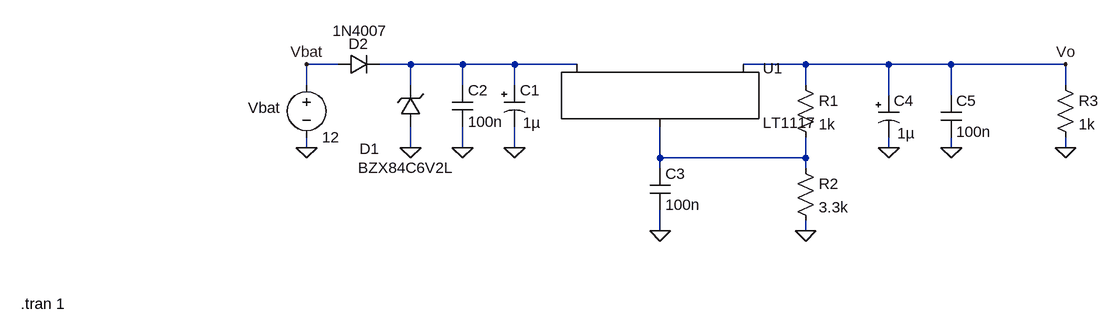
[diagram p0: schematic Regulador.asc]
Regulador.asc, the LTspice schematic file:
Version 4.1
SHEET 1 880 680
WIRE -304 128 -352 128
WIRE -192 128 -240 128
WIRE -112 128 -192 128
WIRE -32 128 -112 128
WIRE 64 128 -32 128
WIRE 416 128 320 128
WIRE 544 128 416 128
WIRE 640 128 544 128
WIRE 816 128 640 128
WIRE -352 160 -352 128
WIRE -192 160 -192 128
WIRE -112 160 -112 128
WIRE -32 160 -32 128
WIRE 416 160 416 128
WIRE 816 160 816 128
WIRE 544 176 544 128
WIRE 640 176 640 128
WIRE -352 256 -352 240
WIRE -192 256 -192 224
WIRE -112 256 -112 224
WIRE -32 256 -32 224
WIRE 544 256 544 240
WIRE 640 256 640 240
WIRE 816 256 816 240
WIRE 192 272 192 224
WIRE 416 272 416 240
WIRE 416 272 192 272
WIRE 192 288 192 272
WIRE 416 288 416 272
WIRE 192 384 192 352
WIRE 416 384 416 368
FLAG -192 256 0
FLAG -112 256 0
FLAG -32 256 0
FLAG -352 256 0
FLAG 192 384 0
FLAG 416 384 0
FLAG 544 256 0
FLAG 640 256 0
FLAG 816 256 0
FLAG 816 128 Vo
FLAG -352 128 Vbat
SYMBOL PowerProducts\\LT1117 192 128 R0
SYMATTR InstName U1
SYMBOL polcap -48 160 R0
WINDOW 3 29 58 Left 2
SYMATTR InstName C1
SYMATTR Value 1µ
SYMBOL cap -128 160 R0
SYMATTR InstName C2
SYMATTR Value 100n
SYMBOL zener -176 224 R180
WINDOW 0 64 -34 Left 2
WINDOW 3 -50 -63 Left 2
SYMATTR InstName D1
SYMATTR Value BZX84C6V2L
SYMBOL diode -304 144 R270
WINDOW 0 32 32 VTop 2
WINDOW 3 83 34 VBottom 2
SYMATTR InstName D2
SYMATTR Value 1N4007
SYMBOL voltage -352 144 R0
WINDOW 0 -90 51 Left 2
WINDOW 123 0 0 Left 0
WINDOW 39 0 0 Left 0
SYMATTR InstName Vbat
SYMATTR Value 12
SYMBOL cap 176 288 R0
SYMATTR InstName C3
SYMATTR Value 100n
SYMBOL res 400 144 R0
SYMATTR InstName R1
SYMATTR Value 1k
SYMBOL res 400 272 R0
SYMATTR InstName R2
SYMATTR Value 3.3k
SYMBOL polcap 528 176 R0
WINDOW 3 29 58 Left 2
SYMATTR InstName C4
SYMATTR Value 1µ
SYMBOL cap 624 176 R0
SYMATTR InstName C5
SYMATTR Value 100n
SYMBOL res 800 144 R0
SYMATTR InstName R3
SYMATTR Value 1k
TEXT -792 496 Left 2 !.tran 1

The netlist it stands for:
* Regulador.asc
X§U1 N002 Vo N001 LT1117
C1 N001 0 1µ
C2 N001 0 100n
D1 0 N001 BZX84C6V2L
D2 Vbat N001 1N4007
Vbat Vbat 0 12
C3 N002 0 100n
R1 Vo N002 1k
R2 N002 0 3.3k
C4 Vo 0 1µ
C5 Vo 0 100n
R3 Vo 0 1k
.model D D
.lib standard.dio
.tran 1
.lib LT1117.lib
.backanno
.end